# EAGLE design ovenboard (EAGLE 8.2.2)
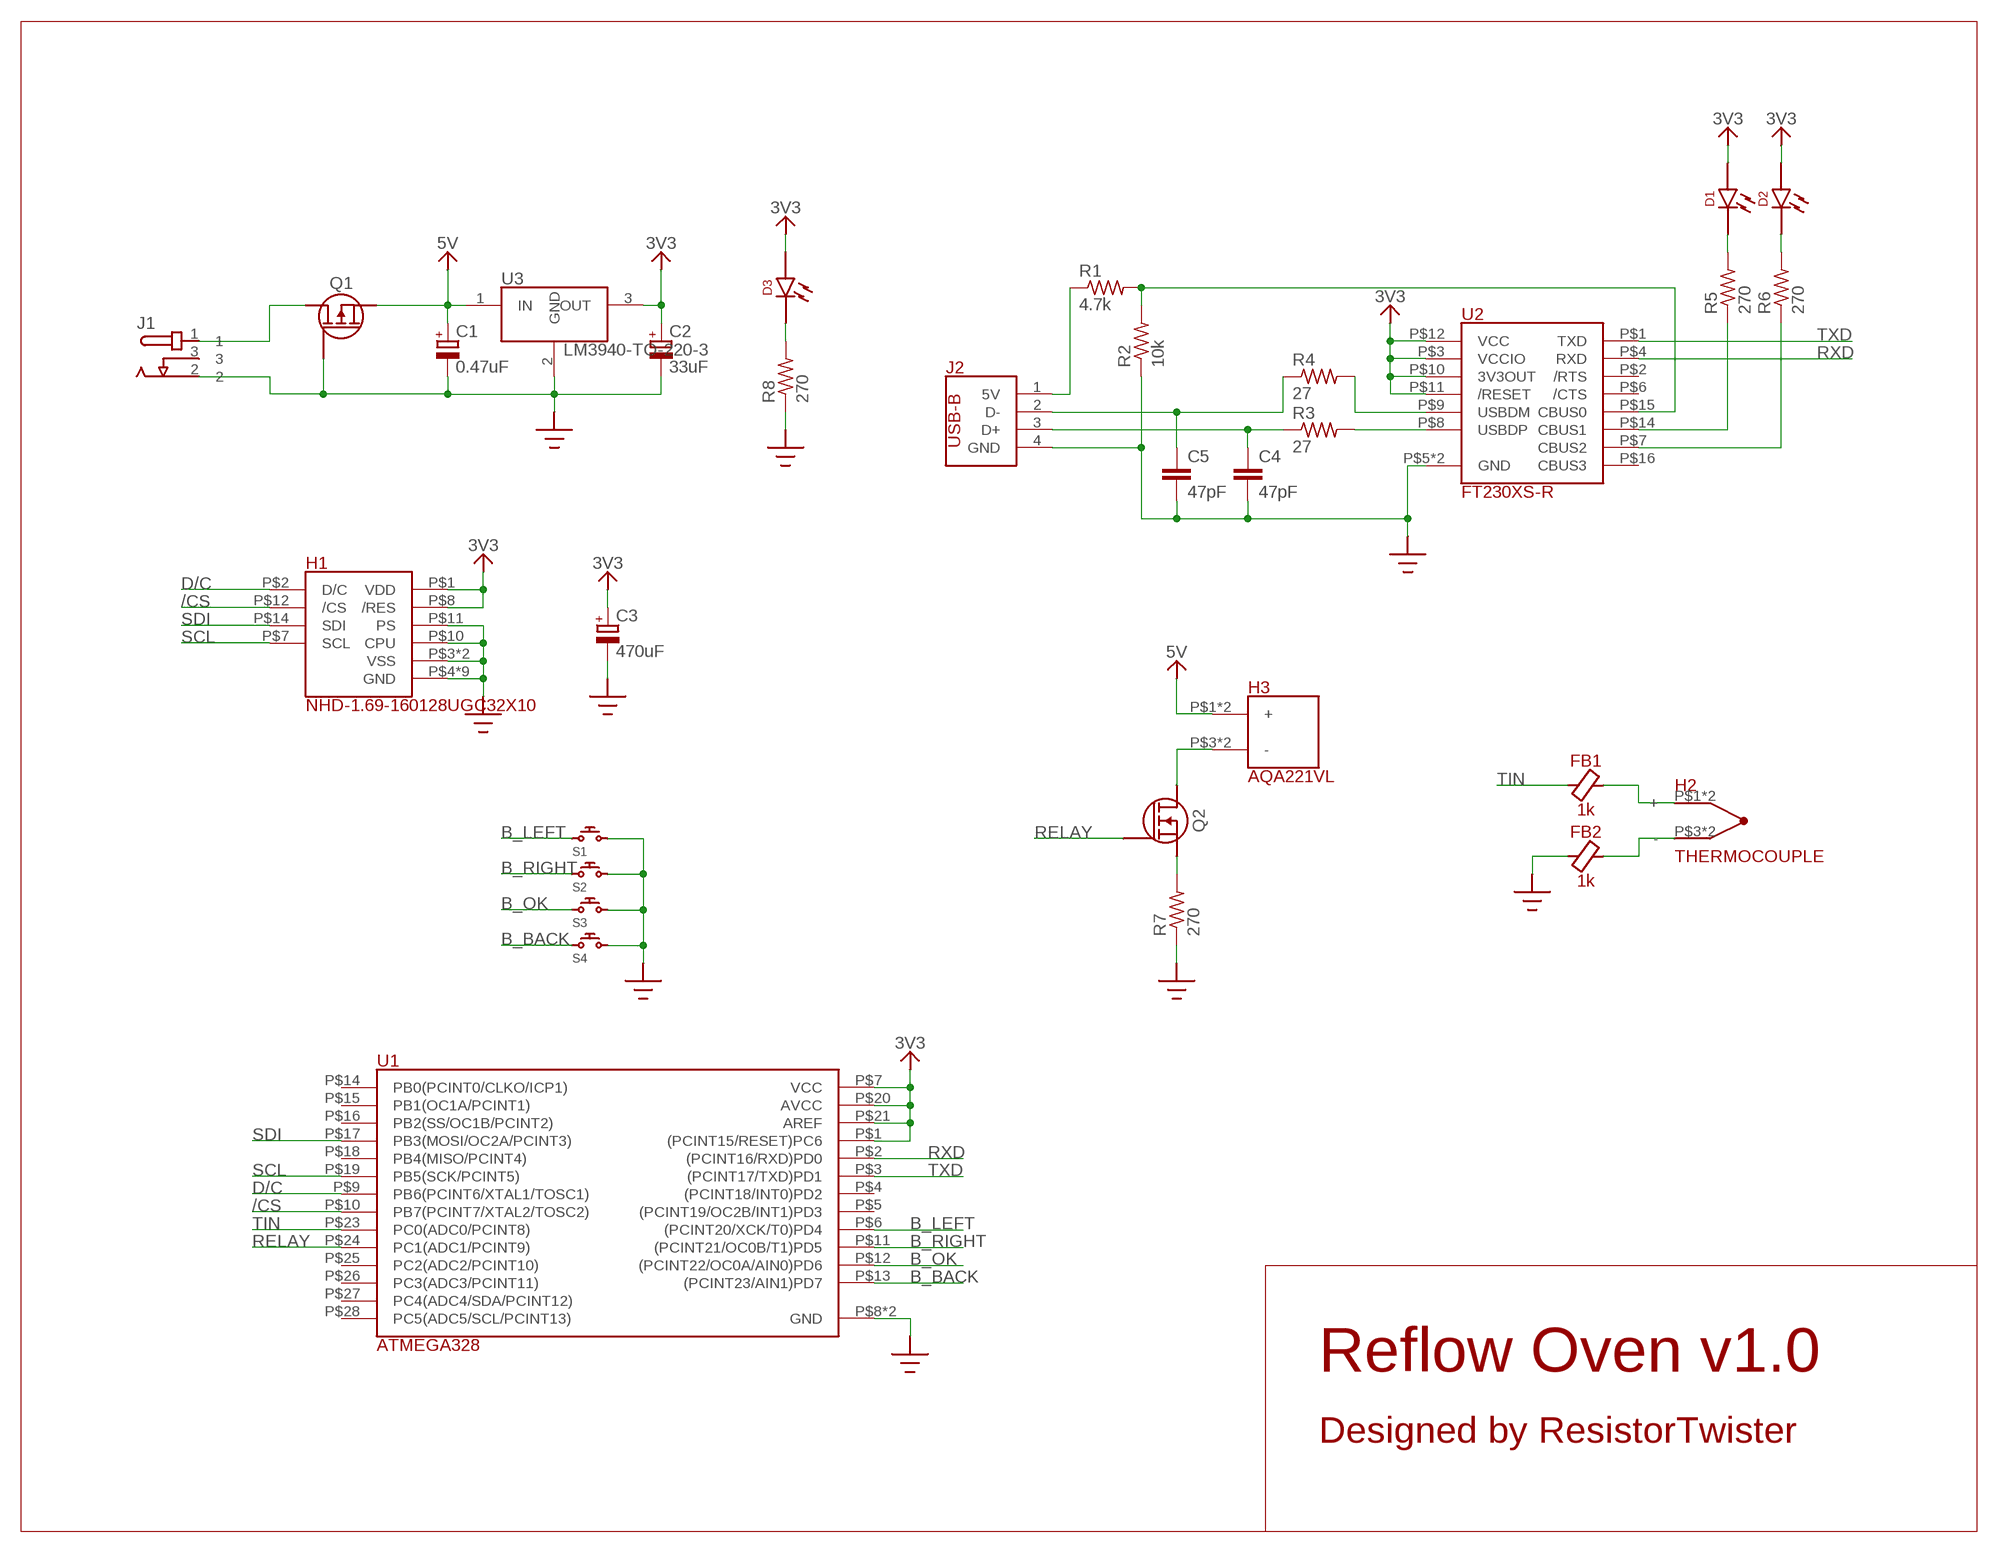
[diagram p0: schematic, sheet 1]

## Parts
C1  0.47uF  CPOL-EUE5-5  [E5-5]
C2  33uF  CPOL-EUE5-5  [E5-5]
C3  470uF  CPOL-EUE5-5  [E5-5]
C4  47pF  C-EU050-024X044  [C050-024X044]
C5  47pF  C-EU050-024X044  [C050-024X044]
D1  LED-5  [LED5]
D2  LED-5  [LED5]
D3  LED-5  [LED5]
FB1  1k  FERRITE-0603  [0603]
FB2  1k  FERRITE-0603  [0603]
H1  NHD-1.69-160128UGC32X10  [2X10HEADER0.1]
H2  THERMOCOUPLE  [2TERMINAL]
H3  AQA221VL  [2TERMINAL]
J1  PJ-202B  [PJ-202B]
J2  USB2.0-B1HSW6  [B1HSW6]
Q1  MOSFET-P-TO-220-3  [TO-220-3]
Q2  MOSFET-N-TO-92  [TO-92]
R1  4.7k  R-US_0204/5  [0204/5]
R2  10k  R-US_0204/5  [0204/5]
R3  27  R-US_0204/5  [0204/5]
R4  27  R-US_0204/5  [0204/5]
R5  270  R-US_0204/5  [0204/5]
R6  270  R-US_0204/5  [0204/5]
R7  270  R-US_0204/5  [0204/5]
R8  270  R-US_0204/5  [0204/5]
S1  PUSHBUTTON  [1X2HEADER0.1]
S2  PUSHBUTTON  [1X2HEADER0.1]
S3  PUSHBUTTON  [1X2HEADER0.1]
S4  PUSHBUTTON  [1X2HEADER0.1]
U1  ATMEGA328  [28DIP0.1]
U2  FT230XS-R  [16SSOP0.025]
U3  LM3940-TO-220-3  [TO-220-3]

## Nets
3V3: C2.+ C3.+ D1.A D2.A D3.A H1.P$1(VDD) H1.P$8(/RES) U1.P$1((PCINT15/RESET)PC6) U1.P$7(VCC) U1.P$20(AVCC) U1.P$21(AREF) U2.P$3(VCCIO) U2.P$10(3V3OUT) U2.P$11(/RESET) U2.P$12(VCC) U3.3(OUT)
5V: C1.+ H3.P$1(+) H3.P$2(+) Q1.2(S) U3.1(IN)
/CS: H1.P$12(/CS) U1.P$10(PB7(PCINT7/XTAL2/TOSC2))
B_BACK: S4.2 U1.P$13((PCINT23/AIN1)PD7)
B_LEFT: S1.2 U1.P$6((PCINT20/XCK/T0)PD4)
B_OK: S3.2 U1.P$12((PCINT22/OC0A/AIN0)PD6)
B_RIGHT: S2.2 U1.P$11((PCINT21/OC0B/T1)PD5)
D/C: H1.P$2(D/C) U1.P$9(PB6(PCINT6/XTAL1/TOSC1))
GND: C1.- C2.- C3.- C4.2 C5.2 FB2.1 H1.P$3(VSS) H1.P$4(GND) H1.P$5(GND) H1.P$6(GND) H1.P$9(GND) H1.P$10(CPU) H1.P$11(PS) H1.P$13(GND) H1.P$15(GND) H1.P$16(GND) H1.P$17(GND) H1.P$18(VSS) H1.P$20(GND) J1.2 J2.4(GND) Q1.1(G) R2.1 R7.1 R8.1 S1.1 S2.1 S3.1 S4.1 U1.P$8(GND) U1.P$22(GND) U2.P$5(GND) U2.P$13(GND) U3.2(GND)
N$1: J1.1 Q1.3(D)
N$5: R3.2 U2.P$8(USBDP)
N$7: C5.1 J2.2(D-) R4.1
N$8: C4.1 J2.3(D+) R3.1
N$11: J2.1(5V) R1.1
N$12: R1.2 R2.2 U2.P$15(CBUS0)
N$13: R5.1 U2.P$14(CBUS1)
N$14: R6.1 U2.P$7(CBUS2)
N$15: R4.2 U2.P$9(USBDM)
N$20: D1.C R5.2
N$21: D2.C R6.2
N$26: FB1.2 H2.P$1(+) H2.P$2(+)
N$27: FB2.2 H2.P$3(-) H2.P$4(-)
N$30: H3.P$3(-) H3.P$4(-) Q2.3(D)
N$31: D3.C R8.2
N$34: Q2.1(S) R7.2
RELAY: Q2.2(G) U1.P$24(PC1(ADC1/PCINT9))
RXD: U1.P$2((PCINT16/RXD)PD0) U2.P$4(RXD)
SCL: H1.P$7(SCL) U1.P$19(PB5(SCK/PCINT5))
SDI: H1.P$14(SDI) U1.P$17(PB3(MOSI/OC2A/PCINT3))
TIN: FB1.1 U1.P$23(PC0(ADC0/PCINT8))
TXD: U1.P$3((PCINT17/TXD)PD1) U2.P$1(TXD)
Unconnected: J1.3 U1.P$4((PCINT18/INT0)PD2) U1.P$5((PCINT19/OC2B/INT1)PD3) U1.P$14(PB0(PCINT0/CLKO/ICP1)) U1.P$15(PB1(OC1A/PCINT1)) U1.P$16(PB2(SS/OC1B/PCINT2)) U1.P$18(PB4(MISO/PCINT4)) U1.P$25(PC2(ADC2/PCINT10)) U1.P$26(PC3(ADC3/PCINT11)) U1.P$27(PC4(ADC4/SDA/PCINT12)) U1.P$28(PC5(ADC5/SCL/PCINT13)) U2.P$2(/RTS) U2.P$6(/CTS) U2.P$16(CBUS3)

## Notes on the sheet
- Reflow Oven v1.0
- Designed by ResistorTwister

## Library data of the parts
C1-C3 = resistor:CPOL-EU: POLARIZED CAPACITOR, European symbol
C4 C5 = resistor:C-EU: CAPACITOR, European symbol
D1-D3 = Resistor-Lib:LED
FB1 FB2 = Resistor-Lib:FERRITE
H1 = Resistor-Lib:NHD-1.69-160128UGC3
H2 = Resistor-Lib:THERMOCOUPLE
H3 = Resistor-Lib:AQA221VL
J1 = Resistor-Lib:PJ-202B
J2 = Resistor-Lib:USB2.0
Q1 = Resistor-Lib:MOSFET-P
Q2 = Resistor-Lib:MOSFET-N
R1-R8 = resistor:R-US_: RESISTOR, American symbol
S1-S4 = Resistor-Lib:PUSHBUTTON
U1 = Resistor-Lib:ATMEGA328
U2 = Resistor-Lib:FT230XS-R
U3 = Resistor-Lib:LM3940

## Board
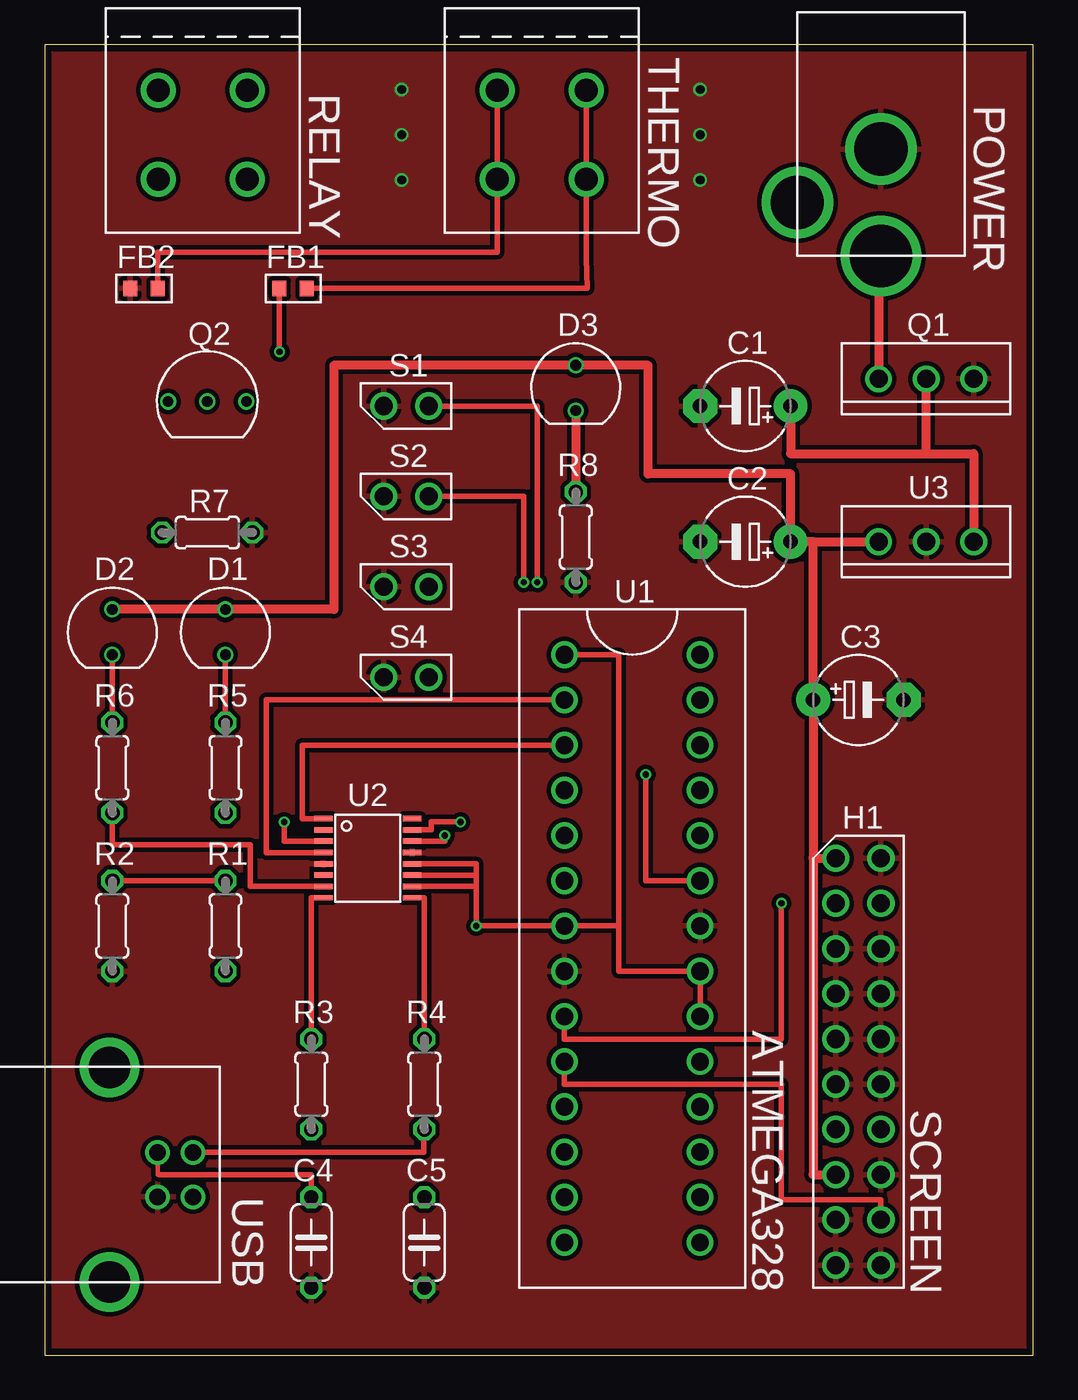
[diagram p1: board, top side]
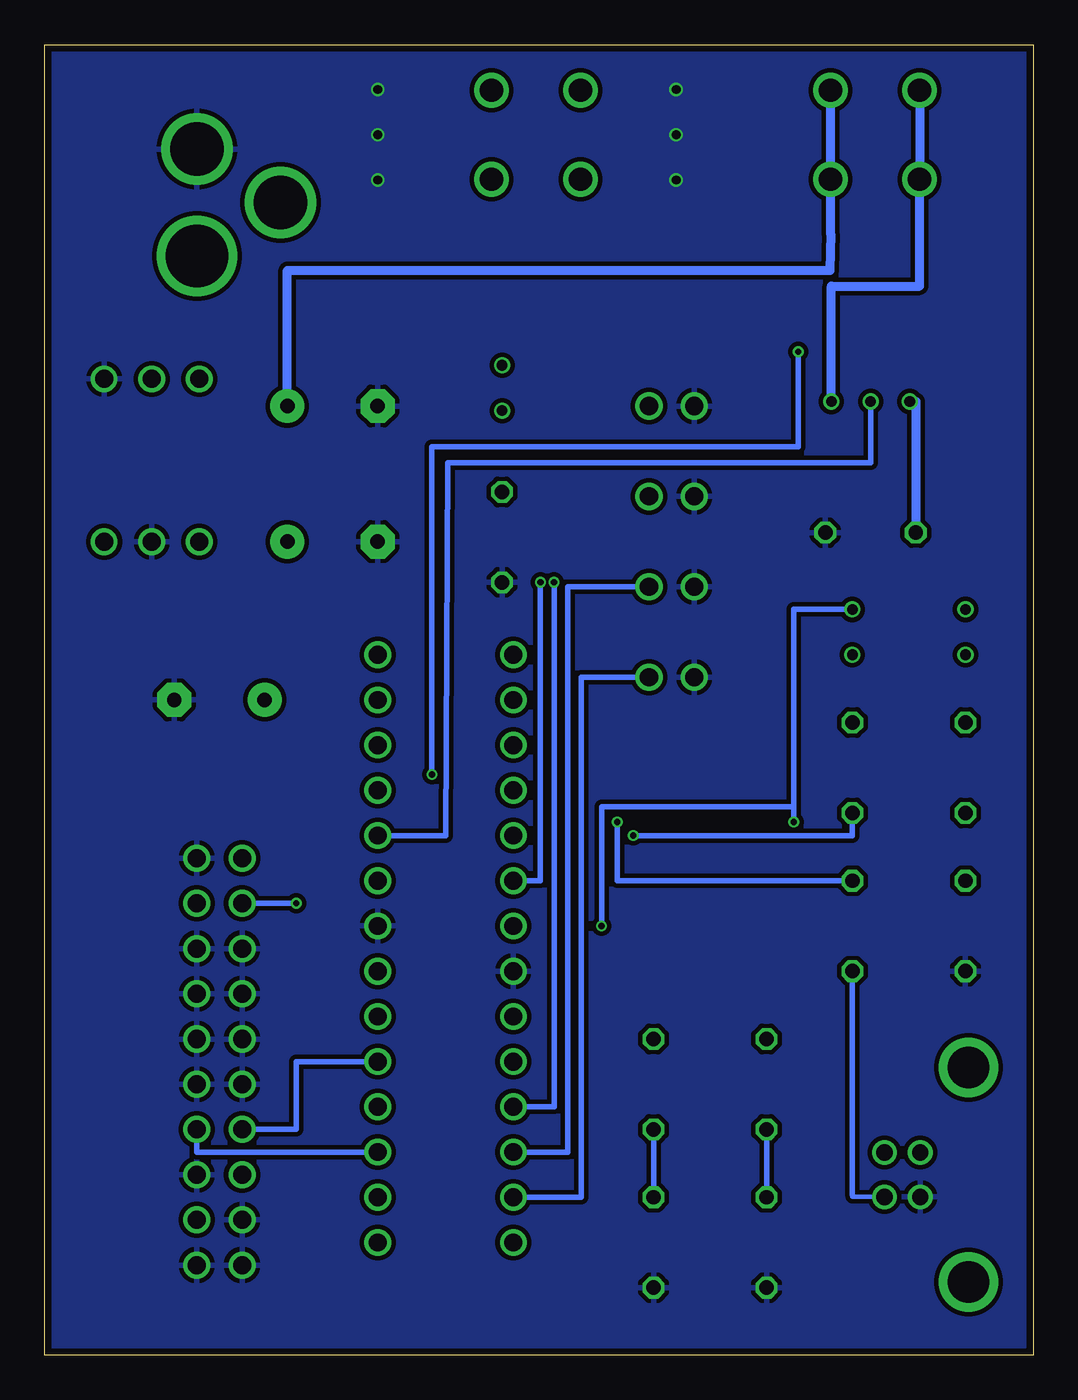
[diagram p2: board, bottom side, seen from below]

Size 55.55 x 73.65 mm. Coordinates in mm from the lower left corner, seen from the top.
Outline: 0,0 55.55,0 55.55,73.65 0,73.65 0,0
Copper layers (1*16): Top 0.035559375mm / dielectric 1.6mm / Bottom 0.035559375mm
Design rules "oshpark-2layer-tented": minimum track width 6mil, minimum drill 10mil, track to track 6mil, track to pad 6mil, pad to pad 6mil, via to via 6mil, smd to smd 6mil, copper to edge 15mil, drill to drill 6mil, minimum pad ring 5mil, minimum via ring 5mil, stop-mask expansion 2.5mil, vias tented up to drill 20mil, thermal gap 10mil

### Footprints (pad centres in the part's own frame; a part is rotated, then mirrored left to right if it is on the bottom)
E5-5 = drill 0.813 pad 1.905: + -2.54,0 | drill 0.813 pad 1.905 octagon: - 2.54,0
C050-024X044 = drill 0.813 octagon: 1 -2.54,0; 2 2.54,0
LED5 = drill 0.6: A -1.27,0; C 1.27,0
0603 = smd 0.787 x 0.864: 1 -0.775,0; 2 0.775,0
2X10HEADER0.1 = drill 1.016: P$1 -11.43,-1.27; P$2 -8.89,-1.27; P$3 -6.35,-1.27; P$4 -3.81,-1.27; P$5 -1.27,-1.27; P$6 1.27,-1.27; P$7 3.81,-1.27; P$8 6.35,-1.27; P$9 8.89,-1.27; P$10 11.43,-1.27; P$11 11.43,1.27; P$12 8.89,1.27; P$13 6.35,1.27; P$14 3.81,1.27; P$15 1.27,1.27; P$16 -1.27,1.27; P$17 -3.81,1.27; P$18 -6.35,1.27; P$19 -8.89,1.27; P$20 -11.43,1.27
2TERMINAL = drill 1.3: P$1 -2.5,2.5; P$2 -2.5,-2.5; P$3 2.5,2.5; P$4 2.5,-2.5
PJ-202B = drill 3.5: 1 -3,0 | drill 3: 2 3,0; 3 0,4.7
B1HSW6 = drill 0.92: 1 1.25,2; 2 -1.25,2; 3 -1.25,0; 4 1.25,0 | drill 2.33: NC@0 -6.02,-2.71; NC@1 6.02,-2.71
TO-220-3 = drill 1: 1 -2.67,0; 2 0,0; 3 2.67,0
TO-92 = drill 0.6: 1 2.2,0; 2 0,0; 3 -2.2,0
0204/5 = drill 0.813 octagon: 1 -2.54,0; 2 2.54,0
1X2HEADER0.1 = drill 1.016: 1 -1.27,0; 2 1.27,0
28DIP0.1 = drill 1: P$1 -16.51,-3.81; P$2 -13.97,-3.81; P$3 -11.43,-3.81; P$4 -8.89,-3.81; P$5 -6.35,-3.81; P$6 -3.81,-3.81; P$7 -1.27,-3.81; P$8 1.27,-3.81; P$9 3.81,-3.81; P$10 6.35,-3.81; P$11 8.89,-3.81; P$12 11.43,-3.81; P$13 13.97,-3.81; P$14 16.51,-3.81; P$15 16.51,3.81; P$16 13.97,3.81; P$17 11.43,3.81; P$18 8.89,3.81; P$19 6.35,3.81; P$20 3.81,3.81; P$21 1.27,3.81; P$22 -1.27,3.81; P$23 -3.81,3.81; P$24 -6.35,3.81; P$25 -8.89,3.81; P$26 -11.43,3.81; P$27 -13.97,3.81; P$28 -16.51,3.81
16SSOP0.025 = smd 0.305 x 1.041: P$1 -2.223,-2.489; P$2 -1.587,-2.489; P$3 -0.953,-2.489; P$4 -0.318,-2.489; P$5 0.318,-2.489; P$6 0.953,-2.489; P$7 1.587,-2.489; P$8 2.223,-2.489; P$9 2.223,2.489; P$10 1.587,2.489; P$11 0.953,2.489; P$12 0.318,2.489; P$13 -0.318,2.489; P$14 -0.953,2.489; P$15 -1.587,2.489; P$16 -2.223,2.489

### Placement (x,y rotation side)
C1  39.37,53.34 180 top
C2  39.37,45.72 180 top
C3  45.72,36.83 0 top
C4  14.99,6.35 270 top
C5  21.34,6.35 270 top
D1  10.16,40.64 270 top
D2  3.81,40.64 270 top
D3  29.84,54.36 270 top
FB1  13.97,59.94 0 top
FB2  5.59,59.94 0 top
H1  45.72,16.51 270 top
H2  27.94,68.58 180 top
H3  8.89,68.58 180 top
J1  46.99,64.77 90 top
J2  6.35,10.16 270 top
Q1  49.53,54.86 180 top
Q2  9.14,53.59 180 top
R1  10.16,24.13 90 top
R2  3.81,24.13 90 top
R3  14.99,15.24 90 top
R4  21.34,15.24 90 top
R5  10.16,33.02 90 top
R6  3.81,33.02 90 top
R7  9.14,46.23 180 top
R8  29.84,45.97 90 top
S1  20.32,53.34 0 top
S2  20.32,48.26 0 top
S3  20.32,43.18 0 top
S4  20.32,38.1 0 top
U1  33.02,22.86 270 top
U2  18.16,27.94 270 top
U3  49.53,45.72 180 top

### Tracks (layer width: path | path; a pad name or v marks a point on that pad's centre or on a via)
3V3  (via drill 0.35)
  Top 0.305: U2.P$3 13.46,28.89 v13.46,29.97 | 32.26,24.13 U1.P$7 v24.26,24.13 24.26,26.35 | 32.26,24.13 32.26,21.59 U1.P$21 U1.P$20 | U1.P$1 32.26,39.37 32.26,24.13 | 24.26,26.35 U2.P$10 | 24.26,26.99 U2.P$11 | 24.26,26.99 24.26,26.35 | U2.P$12 24.26,27.62 24.26,26.99
  Top 0.508: D2.A D1.A 16.26,41.91 16.26,55.63 D3.A 33.91,55.63 33.91,49.53 41.91,49.53 C2.+ 43.18,45.72 | 43.18,27.94 C3.+ 43.18,45.72 | 43.18,27.94 H1.P$1 | 43.18,27.94 43.18,10.16 H1.P$8 | 43.18,45.72 U3.3
  Bottom 0.305: 13.46,30.84 v13.46,29.97 | 13.46,30.84 13.46,41.91 D1.A | 13.46,30.84 24.26,30.84 v24.26,24.13
5V
  Top 0.508: 49.53,50.67 Q1.2 | 49.53,50.67 52.2,50.67 U3.1 | C1.+ 41.91,50.67 49.53,50.67
  Bottom 0.508: C1.+ 41.91,60.96 11.43,60.96 11.39,63.03 H3.P$1 H3.P$2
/CS
  Top 0.305: H1.P$12 46.99,8.76 41.4,8.76 41.4,15.24 29.21,15.24 U1.P$10
B_BACK
  Bottom 0.305: U1.P$13 25.4,8.89 25.4,38.1 S4.2
B_LEFT  (via drill 0.35)
  Top 0.305: S1.2 22.35,53.34 27.69,53.34 v27.69,43.43
  Bottom 0.305: U1.P$6 27.69,26.67 v27.69,43.43
B_OK
  Bottom 0.305: U1.P$12 26.16,11.43 26.16,43.18 S3.2
B_RIGHT  (via drill 0.35)
  Top 0.305: S2.2 26.92,48.26 v26.92,43.43
  Bottom 0.305: U1.P$11 26.92,13.97 v26.92,43.43
D/C  (via drill 0.35)
  Top 0.305: U1.P$9 29.21,17.78 41.4,17.78 v41.4,25.4
  Bottom 0.305: v41.4,25.4 H1.P$2
GND  (via drill 0.5)
  other vias: 36.83,68.58 20.07,68.58 20.07,66.04 20.07,71.12 36.83,71.12 36.83,66.04
  pour Top (isolate 0.254): 0.51,73.15 55.12,73.15 55.12,0.51 0.51,0.51
  pour Bottom (isolate 0.254): 0.51,73.15 55.12,73.15 55.12,0.51 0.51,0.51
N$1
  Top 0.508: J1.1 46.86,61.64 Q1.3
N$5
  Top 0.305: R3.2 14.99,25.72 U2.P$8
N$7
  Top 0.305: J2.2 21.32,11.41 R4.1
  Bottom 0.305: R4.1 C5.1
N$8
  Top 0.254: J2.3 6.35,10.16 6.48,10.16
  Top 0.305: C4.1 14.99,10.16 6.48,10.16
  Bottom 0.305: C4.1 R3.1
N$11
  Bottom 0.254: J2.1 10.16,8.91 10.16,9.02
  Bottom 0.305: 10.16,9.02 R1.1
N$12  (via drill 0.35)
  Top 0.305: R2.2 R1.2 | v23.37,29.97 21.72,29.97 21.72,29.53 U2.P$15
  Bottom 0.305: v23.37,29.97 23.37,26.67 R1.2
N$13  (via drill 0.35)
  Top 0.305: U2.P$14 22.48,28.89 v22.48,29.21
  Bottom 0.305: R5.1 10.16,29.21 v22.48,29.21
N$14
  Top 0.305: U2.P$7 11.56,26.35 11.56,28.7 3.81,28.7 R6.1
N$15
  Top 0.305: R4.2 21.34,25.72 U2.P$9
N$20
  Top 0.305: D1.C R5.2
N$21
  Top 0.305: D2.C R6.2
N$26
  Top 0.305: H2.P$2 H2.P$1 30.44,61.68 30.48,59.94 FB1.2
N$27
  Top 0.305: FB2.2 6.36,61.98 25.44,61.98 H2.P$3 H2.P$4
N$30
  Bottom 0.508: H3.P$4 H3.P$3 6.39,60.07 11.34,60.07 Q2.3
N$31
  Top 0.508: D3.C R8.2
N$34
  Bottom 0.508: Q2.1 6.6,53.59 R7.2
RELAY
  Bottom 0.305: U1.P$24 33.02,29.21 32.89,50.16 9.14,50.16 Q2.2
RXD
  Top 0.305: U2.P$4 12.45,28.26 12.45,36.83 U1.P$2
SCL
  Bottom 0.305: U1.P$19 41.4,16.51 41.4,12.7 H1.P$7
SDI
  Bottom 0.305: H1.P$14 46.99,11.43 U1.P$17
TIN  (via drill 0.35)
  Top 0.305: v33.78,32.64 33.78,26.67 U1.P$23 | FB1.1 13.2,56.39 v13.21,56.39
  Bottom 0.305: v13.21,56.39 13.21,51.05 33.78,51.05 v33.78,32.64
TXD
  Top 0.305: U2.P$1 14.48,30.16 14.48,34.29 U1.P$3

### Text on the board
tPlace: THERMO | RELAY | POWER | ATMEGA328 | SCREEN | USB